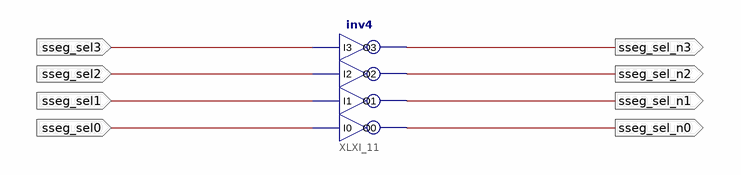
[diagram p0: schematic sheet 1]
// Xilinx ISE schematic Orner_display_en.sch (spartan3e) as structural Verilog: 1 symbols, 8 ports
module Orner_display_en (
  input  sseg_sel0,
  input  sseg_sel3,
  input  sseg_sel1,
  input  sseg_sel2,
  output sseg_sel_n3,
  output sseg_sel_n1,
  output sseg_sel_n0,
  output sseg_sel_n2
);

  inv4 XLXI_11 (
    .I0(sseg_sel0), .I1(sseg_sel1), .I2(sseg_sel2), .I3(sseg_sel3), .O0(sseg_sel_n0), .O1(sseg_sel_n1),
    .O2(sseg_sel_n2), .O3(sseg_sel_n3));
endmodule
